# Altium project Spectrum Analyzer.PrjPcb
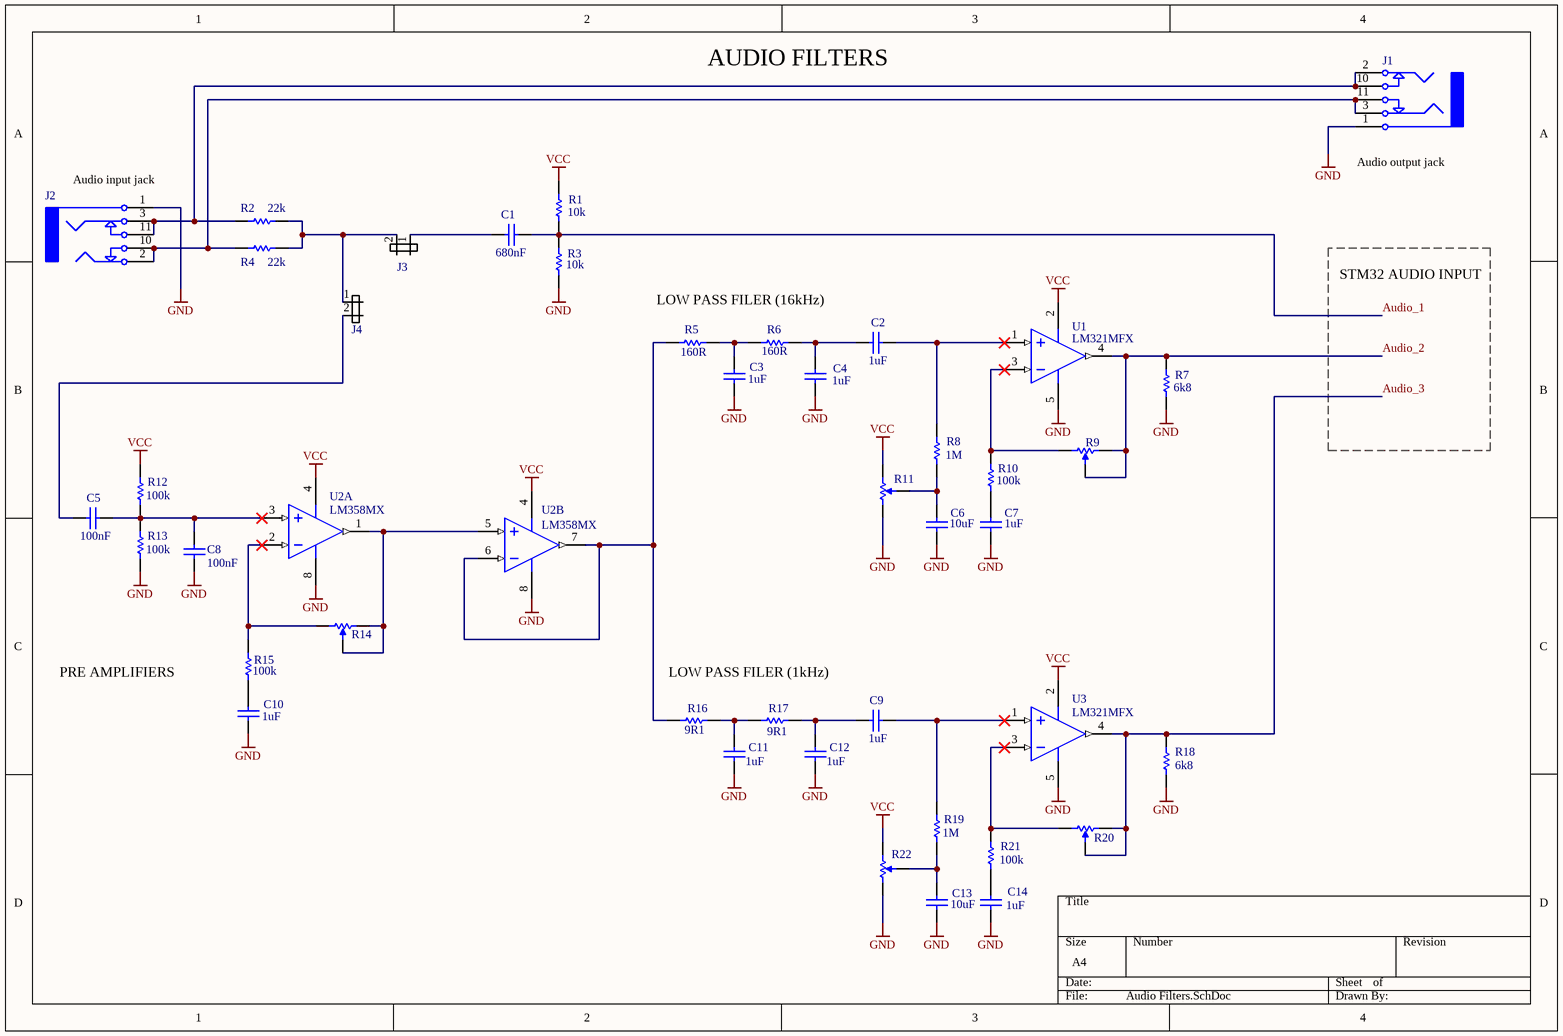
[diagram p0: Audio Filters.SchDoc]
3 sheets, 102 parts. Net scope: global (net labels, ports and power ports of the same name join across sheets).
Board file: PCB1.PcbDoc
Sheets:
  Audio Filters.SchDoc
  Control Units.SchDoc
  Power Supply.SchDoc

## Sheet Audio Filters.SchDoc
size A4

### Parts
C1  value 680nF  [CAPC0603(1608)100_N]  (hidden comment: CAP 680nF 25V 0603(1608))
C2  value 1uF  [CAPC0603(1608)100_N]  (hidden comment: CAP 1uF 16V 0603(1608))
C3  value 1uF  [CAPC0603(1608)100_N]  (hidden comment: CAP 1uF 16V 0603(1608))
C4  value 1uF  [CAPC0603(1608)100_N]  (hidden comment: CAP 1uF 16V 0603(1608))
C5  value 100nF  [CAPC0603(1608)100_N]  (hidden comment: CAP 100nF 25V 0603(1608))
C6  value 10uF  [CAPC0603(1608)100_M]  (hidden comment: CAP 10uF 6.3V 0603(1608))
C7  value 1uF  [CAPC0603(1608)100_N]  (hidden comment: CAP 1uF 16V 0603(1608))
C8  value 100nF  [CAPC0603(1608)100_N]  (hidden comment: CAP 100nF 25V 0603(1608))
C9  value 1uF  [CAPC0603(1608)100_N]  (hidden comment: CAP 1uF 16V 0603(1608))
C10  value 1uF  [CAPC0603(1608)100_N]  (hidden comment: CAP 1uF 16V 0603(1608))
C11  value 1uF  [CAPC0603(1608)100_N]  (hidden comment: CAP 1uF 16V 0603(1608))
C12  value 1uF  [CAPC0603(1608)100_N]  (hidden comment: CAP 1uF 16V 0603(1608))
C13  value 10uF  [CAPC0603(1608)100_M]  (hidden comment: CAP 10uF 6.3V 0603(1608))
C14  value 1uF  [CAPC0603(1608)100_N]  (hidden comment: CAP 1uF 16V 0603(1608))
J1  TSH-3675-BE-PA66-G  [TECHNIC-TSH-3675-BLUE_V]  (value not drawn)
J2  TSH-3675-BE-PA66-G  [TECHNIC-TSH-3675-BLUE_V]  (value not drawn)
J3  (no value)  [J_THT_HDR_1x2_R2.54-V]
J4  (no value)  [J_THT_HDR_1x2_R2.54-V]
R1  value 10k  [RESC0603(1608)_N]  (hidden comment: 10K 1% 0603(1608))
R2  value 22k  [RESC0603(1608)_L]  (hidden comment: 22K 1% 0603(1608))
R3  value 10k  [RESC0603(1608)_N]  (hidden comment: 10K 1% 0603(1608))
R4  value 22k  [RESC0603(1608)_L]  (hidden comment: 22K 1% 0603(1608))
R5  value 160R  [RESC0603(1608)_M]  (hidden comment: 160R 1% 0603(1608))
R6  value 160R  [RESC0603(1608)_M]  (hidden comment: 160R 1% 0603(1608))
R7  value 6k8  [RESC0603(1608)_L]  (hidden comment: 6K81 1% 0603(1608))
R8  value 1M  [RESC0603(1608)_L]  (hidden comment: 1M 1% 0603(1608))
R9  35WR10KLFTR  [BI-35WR10KLFTR-3_V]  (value not drawn)
R10  value 100k  [RESC0603(1608)_N]  (hidden comment: 100K 5% 0603(1608))
R11  35WR10KLFTR  [BI-35WR10KLFTR-3_V]  (value not drawn)
R12  value 100k  [RESC0603(1608)_N]  (hidden comment: 100K 5% 0603(1608))
R13  value 100k  [RESC0603(1608)_N]  (hidden comment: 100K 5% 0603(1608))
R14  35WR10KLFTR  [BI-35WR10KLFTR-3_V]  (value not drawn)
R15  value 100k  [RESC0603(1608)_N]  (hidden comment: 100K 5% 0603(1608))
R16  value 9R1  [RESC0603(1608)_M]  (hidden comment: 9R1 1% 0603(1608))
R17  value 9R1  [RESC0603(1608)_M]  (hidden comment: 9R1 1% 0603(1608))
R18  value 6k8  [RESC0603(1608)_L]  (hidden comment: 6K81 1% 0603(1608))
R19  value 1M  [RESC0603(1608)_L]  (hidden comment: 1M 1% 0603(1608))
R20  35WR10KLFTR  [BI-35WR10KLFTR-3_V]  (value not drawn)
R21  value 100k  [RESC0603(1608)_N]  (hidden comment: 100K 5% 0603(1608))
R22  35WR10KLFTR  [BI-35WR10KLFTR-3_V]  (value not drawn)
U1  LM321MFX  [DBV0005A_L]
U2  LM358MX  [D0008A_M]  (parts A,B of 2)
U3  LM321MFX  [DBV0005A_L]

### Nets
GND: C3.1 C4.1 C6.1 C7.1 C8.2 C10.1 C11.1 C12.1 C13.1 C14.1 J1.1 J2.1 R3.1 R7.1 R11.1 R13.1 R18.1 R22.1 U1.5(V+) U2.8(V+) U3.5(V+)
VCC: R1.2 R11.3 R12.2 R22.3 U1.2(V-) U2.4(GND) U3.2(V-)
Audio_1: C1.2 R1.1 R3.2
Audio_2: R7.2 R9.2 R9.3 U1.4(OUT)
Audio_3: R18.2 R20.2 R20.3 U3.4(OUT)
NetC1_1: C1.1 J3.1
NetC2_1: C2.1 R8.2 U1.1(IN+)
NetC2_2: C2.2 C4.2 R6.2
NetC3_2: C3.2 R5.2 R6.1
NetC5_1: C5.1 C8.1 R12.1 R13.2 U2.3(INA+)
NetC5_2: C5.2 J4.2
NetC6_2: C6.2 R8.1 R11.2
NetC7_2: C7.2 R10.1
NetC9_1: C9.1 R19.2 U3.1(IN+)
NetC9_2: C9.2 C12.2 R17.2
NetC10_2: C10.2 R15.1
NetC11_2: C11.2 R16.2 R17.1
NetC13_2: C13.2 R19.1 R22.2
NetC14_2: C14.2 R21.1
NetJ1_2: J1.2 J1.10 J2.3 J2.11 R2.1
NetJ1_3: J1.3 J1.11 J2.2 J2.10 R4.1
NetJ3_2: J3.2 J4.1 R2.2 R4.2
NetR5_1: R5.1 R16.1 U2.6(INB-) U2.7(OUTB)
NetR9_1: R9.1 R10.2 U1.3(IN-)
NetR14_1: R14.1 R15.2 U2.2(INA-)
NetR14_2: R14.2 R14.3 U2.1(OUTA) U2.5(INB+)
NetR20_1: R20.1 R21.2 U3.3(IN-)

### Notes on the sheet
- AUDIO FILTERS
- (near J1) Audio output jack
- (near J2) Audio input jack
- LOW PASS FILER (16kHz)
- STM32 AUDIO INPUT
- PRE AMPLIFIERS
- LOW PASS FILER (1kHz)

### Library data of the parts
C1 = CMP-1035-02722-1: CAP 680nF 25V ±10% 0603 (1608 Metric) Thickness 1mm SMD; Case-Metric: 1608; Tolerance: Â±10%; Case-EIA: 0603; Max Thickness: 1 mm; Technology: SMT; Rated Voltage: 25 V
C2-C4 C7 C9-C12 C14 = CMP-1035-02736-1: CAP 1uF 16V ±5% 0603 (1608 Metric) Thickness 1mm SMD; Case-Metric: 1608; Case-EIA: 0603; Tolerance: Â±5%; Technology: SMT; Max Thickness: 1 mm; Rated Voltage: 16 V
C5 C8 = CMP-1035-02589-1: CAP 100nF 25V ±20% 0603 (1608 Metric) Thickness 1mm SMD; Case-EIA: 0603; Tolerance: Â±20%; Case-Metric: 1608; Max Thickness: 1 mm; Technology: SMT; Rated Voltage: 25 V
C6 C13 = CMP-1035-02796-1: CAP 10uF 6.3V ±10% 0603 (1608 Metric) Thickness 1mm SMD; Case-EIA: 0603; Tolerance: Â±10%; Case-Metric: 1608; Technology: SMT; Rated Voltage: 6.3 V; Max Thickness: 1 mm
J1 J2 = CMP-0437-00002-1: Connector, 3.5mm Stereo Audio Socket, Blue; Manufacturer: Technik Industrial; Mounting Technology: Through Hole; DatasheetVersion: Feb-10; ComponentLink1URL: http://www.technik.com.hk/; ComponentLink2Description: Datasheet; PartNumber: TSH-3675-BE-PA66-G; PackageDescription: 3.5mm Stereo Audio Socket, Blue; PackageReference: TSH-3675; ComponentLink1Description: Manufacturer URL; ComponentLink2URL: http://www.technik.com.hk/images/pdf_product/SH367-PA66-C.pdf
J3 J4 = J_HDR_1x2_JUMPER: Złącze gold pin 1x2 na jumper
R1 R3 = CMP-1012-00623-1: 10K 0.1W 1% 0603 (1608 Metric)  SMD; Case-EIA: 0603; Case-Metric: 1608; Power: 0.1 W; Tolerance: 1 %; Technology: SMT
R2 R4 = CMP-1012-00659-1: 22K 0.1W 1% 0603 (1608 Metric)  SMD; Case-EIA: 0603; Case-Metric: 1608; Technology: SMT; Power: 0.1 W; Tolerance: 1 %
R5 R6 = CMP-1012-00418-1: 160R 0.1W 1% 0603 (1608 Metric)  SMD; Case-Metric: 1608; Case-EIA: 0603; Tolerance: 1 %; Technology: SMT; Power: 0.1 W
R7 R18 = CMP-1012-00605-1: 6K81 0.1W 1% 0603 (1608 Metric)  SMD; Case-EIA: 0603; Case-Metric: 1608; Tolerance: 1 %; Power: 0.1 W; Technology: SMT
R8 R19 = CMP-1012-00849-1: 1M 0.1W 1% 0603 (1608 Metric)  SMD; Case-EIA: 0603; Case-Metric: 1608; Power: 0.1 W; Tolerance: 1 %; Technology: SMT
R9 R11 R14 R20 R22 = CMP-1745-00001-1: 3 mm Single-Turn Open Frame Surface Mount Cermet Trimming Potentiometer, +/- 25%, 35 W, -40 to 125 degC, 3-Pin SMD, RoHS, Tape and Reel; Frequency: 16 MHz; Load Capacitance: 20 pF; Frequency Tolerance: 30ppm; ESR: 40 Ohm; Tolerance: 50ppm; Capacitance: 2E-11 f; Packaging: Tape and Reel; Min Operating Temperature: -20degC; Height: 0.177 inch; ComponentLink1URL: http://www.bi-technologies.net/; Radiation Hardening: No; Mount: Surface Mount; ComponentLink2Description: Datasheet; Pins: 2; Max Operating Temperature: 70degC; DatasheetVersion: Feb-10; PackageDescription: 3-Pin Surface Mount Device, Body 3 x 3.1 mm; Package Quantity: 1; RoHSCompliant: True; ComponentLink1Description: Manufacturer URL; PackageReference: 35WR10KLFTR; ComponentLink2URL: http://www.bitechnologies.com/pdfs/35.pdf; REACH SVHC: No SVHC; Resistance: 40 Ohm; Width: 0.197 inch; Length: 0.461 inch
R10 R12 R13 R15 R21 = CMP-1012-00122-1: 100K 0.1W 5% 0603 (1608 Metric)  SMD; Case-EIA: 0603; Case-Metric: 1608; Tolerance: 5 %; Power: 0.1 W; Technology: SMT
R16 R17 = CMP-1012-00280-1: 9R1 0.1W 1% 0603 (1608 Metric)  SMD; Case-Metric: 1608; Case-EIA: 0603; Technology: SMT; Tolerance: 1 %; Power: 0.1 W
U1 U3 = CMP-0055-01337-3: Low Power Single Op Amp, 5-pin SOT-23; Manufacturer: Texas Instruments; PowerWise: N; CompType: Amplifiers; PackageTopMarking: A63A*XTT; ComponentLink1Description: Datasheet URL; PackageDescription: Molded SOT-23, .115 x .063 x .040 in Body, 5 Lead, .0375 in Pitch; PinCount: 5; ComponentLink1URL: http://www.ti.com/general/docs/lit/getliterature.tsp?genericPartNumber=LM321&fileType=pdf; RoHS: N; Package Reference: DBV0005A
U2 = CMP-0055-00630-3: Low Power Dual Operational Amplifier, 8-pin Narrow SOIC; Manufacturer: Texas Instruments; PowerWise: N; PackageTopMarking: NSZXTT*LM*358M; CompType: Amplifiers; ComponentLink1URL: http://www.ti.com/general/docs/lit/getliterature.tsp?genericPartNumber=LM358-N&fileType=pdf; PinCount: 8; PackageDescription: SOIC Narrow, 4.9 x 3.9 x 1.45mm, 8 Lead, 1.27mm Pitch; Code_IPC: SOIC127P600-8; RoHS: N; Code_JEDEC: MS-012-AA; Package Reference: D0008A; ComponentLink1Description: Datasheet URL; PartId: 1

## Sheet Control Units.SchDoc
size A3
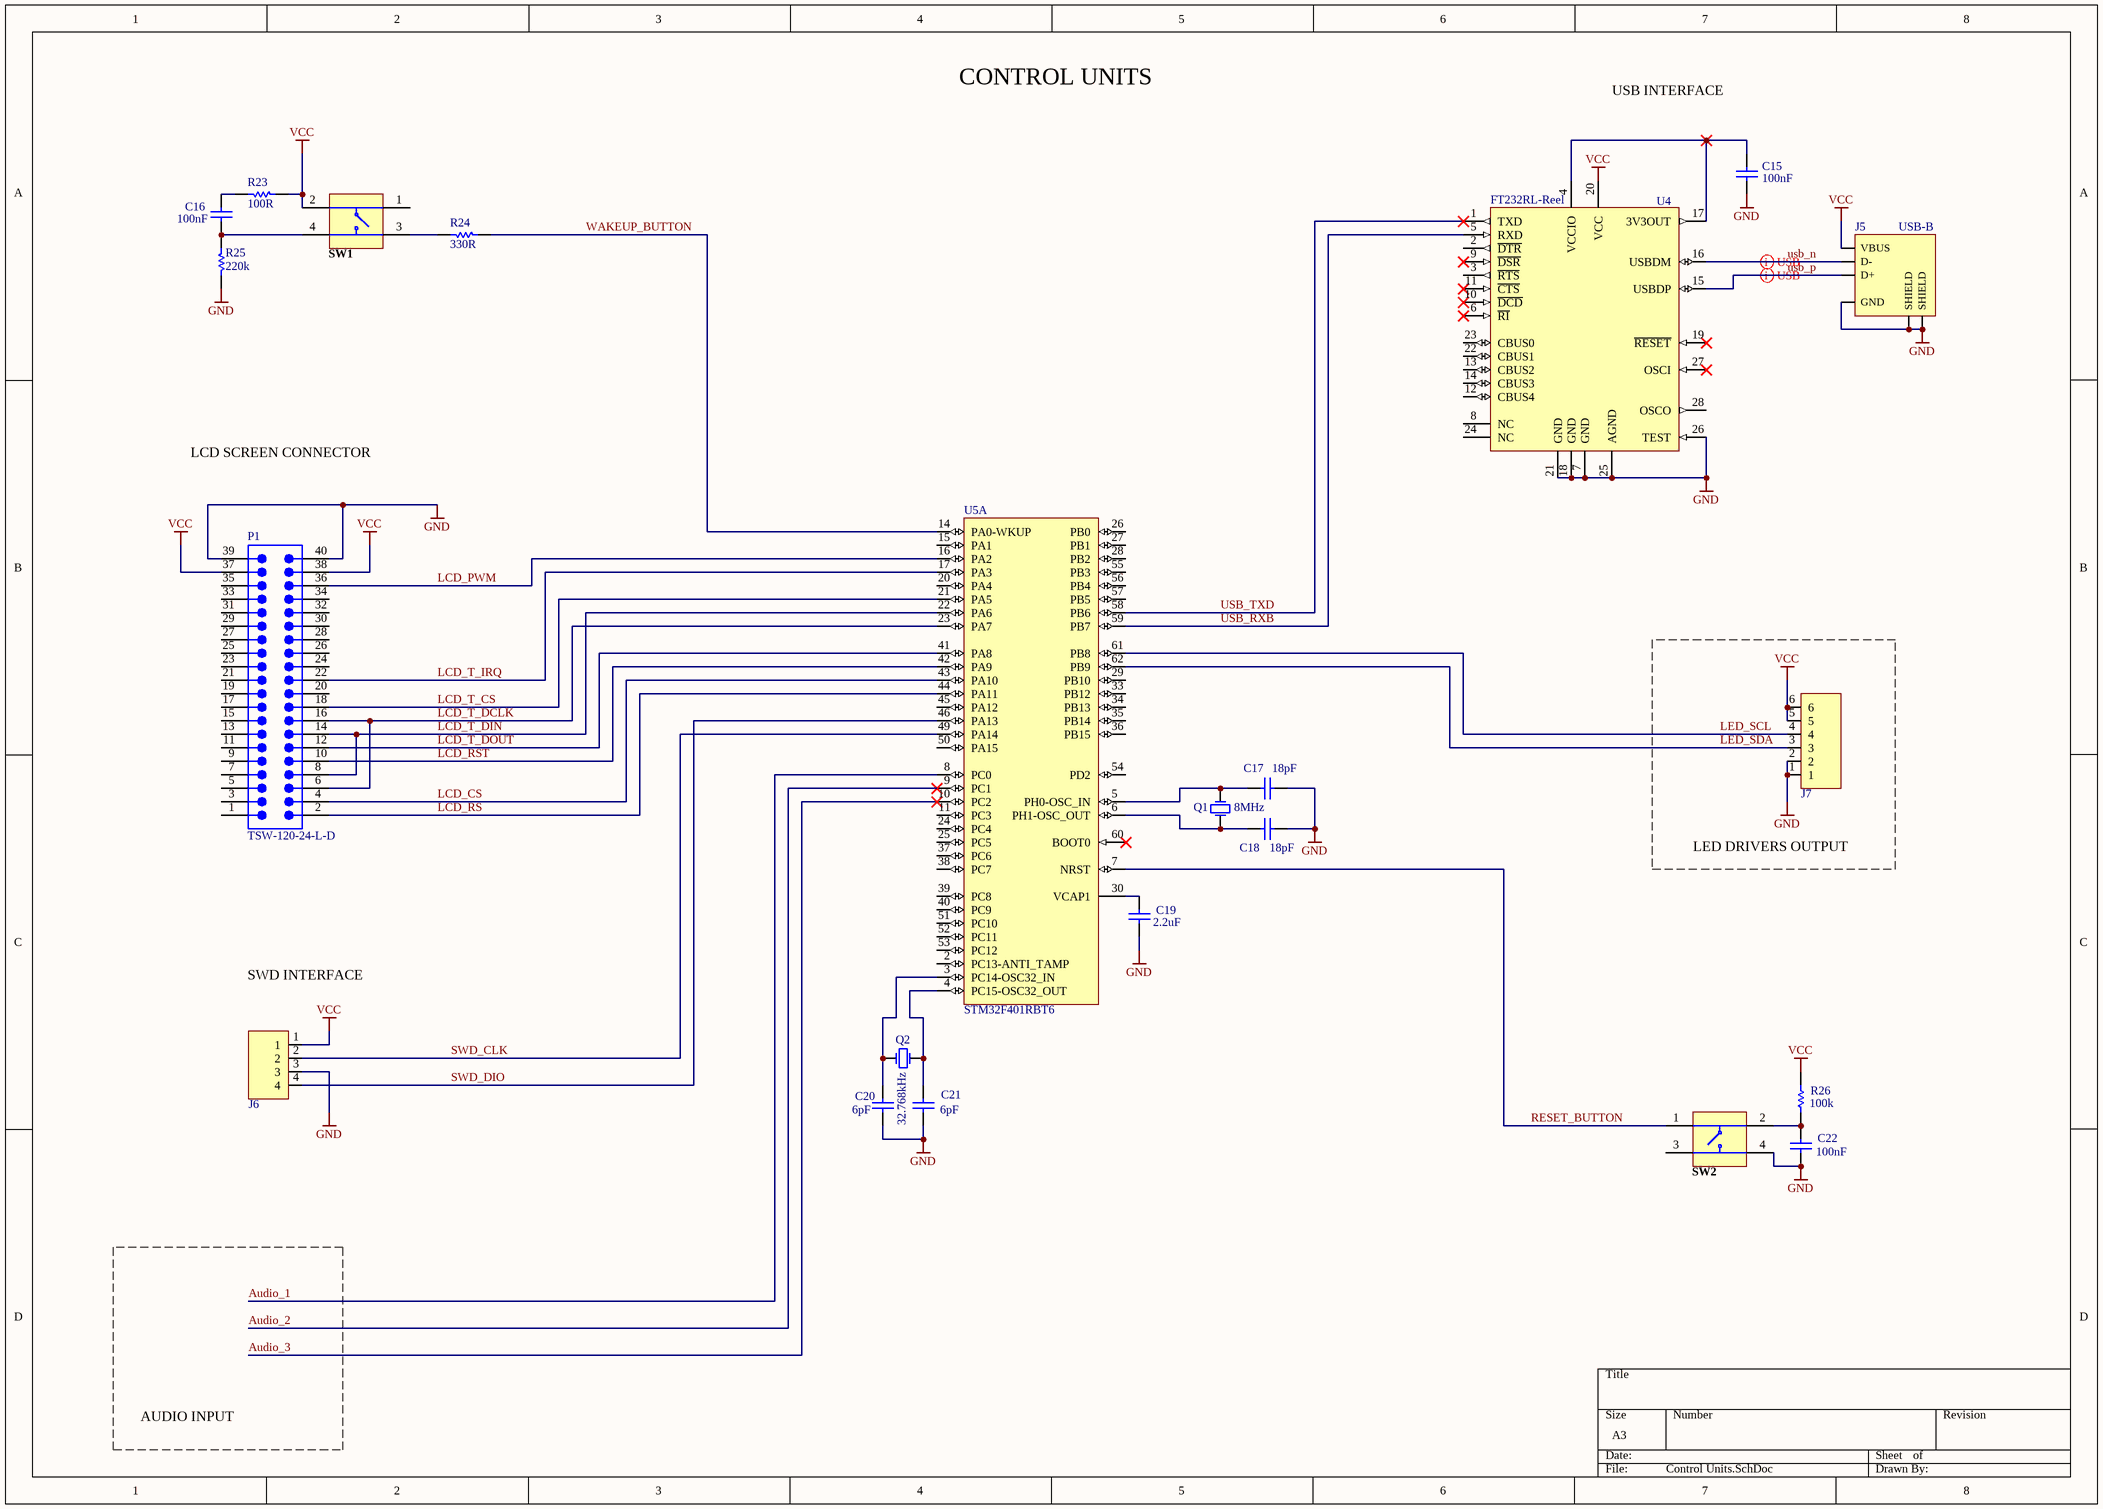
[diagram p1: Control Units.SchDoc]

### Parts
(Parts that share a designator on the sheet are numbered #1, #2 ... from top to bottom, then left to right.)
C15  value 100nF  [CAPC0603(1608)100_N]  (hidden comment: CAP 100nF 25V 0603(1608))
C16  value 100nF  [CAPC0603(1608)100_N]  (hidden comment: CAP 100nF 25V 0603(1608))
C17  value 18pF  [CAPC0603(1608)100_L]  (hidden comment: CAP 18pF 200V 0603(1608))
C18  value 18pF  [CAPC0603(1608)100_L]  (hidden comment: CAP 18pF 200V 0603(1608))
C19  value 2.2uF  [CAPC0603(1608)100_M]  (hidden comment: CAP 2.2uF 25V 0603(1608))
C20  value 6pF  [CAPC0603(1608)100_L]  (hidden comment: CAP 6pF 50V 0603(1608))
C21  value 6pF  [CAPC0603(1608)100_L]  (hidden comment: CAP 6pF 50V 0603(1608))
C22  value 100nF  [CAPC0603(1608)100_N]  (hidden comment: CAP 100nF 25V 0603(1608))
J5  USB-B  [UBS B]
J6  (no value)  [J_THT_HDR_1x4_R2.54-V]
J7  DS1021-1*40SF11  [J_THT_HDR_1x6_R2.54-V]  (value not drawn)
P1  TSW-120-24-L-D  [SMTC-TSW-120-24-X-D]
Q1  8MHz  [HC49SM]
Q2  32.768kHz  [PKG_CFPX-217]
R23  value 100R  [RESC0603(1608)_M]  (hidden comment: 100R 1% 0603(1608))
R24  value 330R  [RESC0603(1608)_L]  (hidden comment: 330R 1% 0603(1608))
R25  value 220k  [RESC0603(1608)_L]  (hidden comment: 220K 1% 0603(1608))
R26  value 100k  [RESC0603(1608)_N]  (hidden comment: 100K 5% 0603(1608))
SW1  TVCM01-038B  [JNFU-TVCM01-038B_V]  (value not drawn)
SW2  TVCM01-038B  [JNFU-TVCM01-038B_V]  (value not drawn)
U4  FT232RL-Reel  [SSOP-28_L]
U5#1  STM32F401RBT6  [STM-LQFP64_N]  (part A of 2)

### Blocks framed on the sheet
LED DRIVERS OUTPUT: J7

### Nets
GND: C15.2 C17.1 C18.1 C19.1 C20.2 C21.1 C22.2 J5.4(GND) J5.5(SHIELD) J5.6(SHIELD) J6.3 J7.1 J7.2 P1.39 P1.40 R25.1 SW2.4 U4.7(GND) U4.18(GND) U4.21(GND) U4.25(AGND) U4.26(TEST)
VCC: J5.1(VBUS) J6.1 J7.5 J7.6 P1.37 P1.38 R23.2 R26.2 SW1.2 U4.20(VCC)
Audio_1: U5#1.8(PC0)
Audio_2: U5#1.9(PC1)
Audio_3: U5#1.10(PC2)
LCD_CS: P1.4 U5#1.43(PA10)
LCD_PWM: P1.36 U5#1.16(PA2)
LCD_RS: P1.2 U5#1.44(PA11)
LCD_RST: P1.10 U5#1.42(PA9)
LCD_T_CS: P1.18 U5#1.21(PA5)
LCD_T_DCLK: P1.6 P1.16 U5#1.23(PA7)
LCD_T_DIN: P1.8 P1.14 U5#1.22(PA6)
LCD_T_DOUT: P1.12 U5#1.41(PA8)
LCD_T_IRQ: P1.22 U5#1.17(PA3)
LED_SCL: J7.4 U5#1.61(PB8)
LED_SDA: J7.3 U5#1.62(PB9)
RESET_BUTTON: SW2.1 U5#1.7(NRST)
SWD_CLK: J6.2 U5#1.49(PA14)
SWD_DIO: J6.4 U5#1.46(PA13)
usb_n: J5.3(D-) U4.16(USBDM)
usb_p: J5.2(D+) U4.15(USBDP)
USB_RXB: U4.5(RXD) U5#1.59(PB7)
USB_TXD: U4.1(TXD) U5#1.58(PB6)
WAKEUP_BUTTON: R24.1 U5#1.14(PA0-WKUP)
NetC15_1: C15.1 U4.4(VCCIO) U4.17(3V3OUT)
NetC16_1: C16.1 R23.1
NetC16_2: C16.2 R25.2 SW1.4
NetC17_2: C17.2 Q1.2(OSC2) U5#1.5(PH0-OSC_IN)
NetC18_2: C18.2 Q1.1(OSC1) U5#1.6(PH1-OSC_OUT)
NetC19_2: C19.2 U5#1.30(VCAP1)
NetC20_1: C20.1 Q2.2(OSC2) U5#1.3(PC14-OSC32_IN)
NetC21_2: C21.2 Q2.1(OSC1) U5#1.4(PC15-OSC32_OUT)
NetC22_1: C22.1 R26.1 SW2.2
NetR24_2: R24.2 SW1.3

Not connected (* = marked no-connect by the designer): P1 1 3 5 7 9 11 13 15 17 19 20 21 23 24 25 26 27 28 29 30 31 32 33 34 35; SW1 1; SW2 3; U4 2(~{DTR}) 3(~{RTS}) 6(~{RI})* 8(NC) 9(~{DSR})* 10(~{DCD})* 11(~{CTS})* 12(CBUS4) 13(CBUS2) 14(CBUS3) 19(~{RESET})* 22(CBUS1) 23(CBUS0) 24(NC) 27(OSCI)* 28(OSCO); U5#1 2(PC13-ANTI_TAMP) 11(PC3) 15(PA1) 20(PA4) 24(PC4) 25(PC5) 26(PB0) 27(PB1) 28(PB2) 29(PB10) 33(PB12) 34(PB13) 35(PB14) 36(PB15) 37(PC6) 38(PC7) 39(PC8) 40(PC9) 45(PA12) 50(PA15) 51(PC10) 52(PC11) 53(PC12) 54(PD2) 55(PB3) 56(PB4) 57(PB5) 60(BOOT0)*

### Layout directives
differential pair: usb_n, usb_p

### Notes on the sheet
- CONTROL UNITS
- USB INTERFACE
- LCD SCREEN CONNECTOR
- SWD INTERFACE
- AUDIO INPUT

### Library data of the parts
C15 C16 C22 = CMP-1035-02589-1: as C5 on sheet Audio Filters; Max Thickness: 1 mm; Technology: SMT; Rated Voltage: 25 V
C17 C18 = CMP-1035-00761-1: CAP 18pF 200V ±5% 0603 (1608 Metric) Thickness 1mm SMD; Tolerance: Â±5%; Case-Metric: 1608; Case-EIA: 0603; Max Thickness: 1 mm; Technology: SMT; Rated Voltage: 200 V
C19 = CMP-1035-02767-1: CAP 2.2uF 25V ±10% 0603 (1608 Metric) Thickness 1mm SMD; Case-EIA: 0603; Tolerance: Â±10%; Case-Metric: 1608; Technology: SMT; Max Thickness: 1 mm; Rated Voltage: 25 V
C20 C21 = CMP-1035-00393-1: CAP 6pF 50V ±0.5pF 0603 (1608 Metric) Thickness 1mm SMD; Case-EIA: 0603; Tolerance: Â±0.5pF; Case-Metric: 1608; Technology: SMT; Max Thickness: 1 mm; Rated Voltage: 50 V
J5 = USB-B: Universal Serial Bus, Type B - 90° Receptacle (TH); Manufacturer: YAMAICHI ELECTRONICS; Component_author: Kajetan Śpionek; Value: USB-B port; HelpURL: http://www.glyn.com/data/glyn/media/doc/USB-B-001-RoHs.pdf; Supplier 1: Farnell; Supplier Part Number 1: 2112373
J6 = J_HDR_1x4: Złącze gold pin
J7 = J_HDR_1x6: Złącze gold pin; EMED_ID: J_HDR_1x6_THT_HDR_1x4_R2.54-V; Producent: CONNFLY; Author_FOOTPRINT: s.szwaczyk@emed.pl; Value: DS1021-1*40SF11; ComponentLink1Description: &Datasheet; ComponentLink1URL: http://www.tme.eu/pl/Document/347cfcc6d022658d2bea6c8b28397055/DS1021.pdf; ComponentLink2Description: &Nota Aplikacyjna; ComponentLink2URL: *; Distributor1: TME; Distributor1_ID: ZL201-40G; Distributor2: *; Distributor2_ID: *; HelpURL: http://www.tme.eu/pl/Document/347cfcc6d022658d2bea6c8b28397055/DS1021.pdf; Type: *; Current_RATED: *; Author_SYMBOL: s.szwaczyk@emed.pl; ESR: *; Power_RATED: *; Producent_ID: DS1021-1*40SF11; Series: *; Temperature_RATED: *; Tolerance: *; Voltage_AC: *; Voltage_DC: *; Voltage_RATED: *
P1 = CMP-1024-00454-1: Manufacturer: Samtec; Pitch: 2.54 mm; ComponentLink1Description: Manufacturer URL; ComponentLink3URL: http://www.samtec.com/documents/webfiles/cpdf/TSW-XXX-XX-XXX-X-XX-XXX-MKT.pdf; PackageVersion: DM, 8/1988; Orientation: Vertical; Mounting Technology: Through-hole; PackageDescription: .025[0.64] SQ. Post Terminal Strip Assembly; Temperature Range: -55 to 125 degC; ComponentLink1URL: http://www.samtec.com; PartNumber: TSW-120-24-L-D; DatasheetVersion: F-214; ComponentLink2URL: http://www.samtec.com/documents/webfiles/pdf/TSW_TH.PDF; ComponentLink3Description: Package Specification; RoHS: True; PackageReference: TSW-120-24-X-D; ComponentLink2Description: Datasheet
Q1 = Q_LFXTAL003151: Kwarc 8MHz, HC49SM; Value: 8MHz
Q2 = Q_CFPX-217: Kwarc 32.768kHz, CFPX-217; Value: 32.768kHz
R23 = CMP-1012-00397-1: 100R 0.1W 1% 0603 (1608 Metric)  SMD; Case-EIA: 0603; Case-Metric: 1608; Technology: SMT; Tolerance: 1 %; Power: 0.1 W
R24 = CMP-1012-00454-1: 330R 0.1W 1% 0603 (1608 Metric)  SMD; Case-Metric: 1608; Case-EIA: 0603; Tolerance: 1 %; Technology: SMT; Power: 0.1 W
R25 = CMP-1012-00772-1: 220K 0.1W 1% 0603 (1608 Metric)  SMD; Case-EIA: 0603; Case-Metric: 1608; Tolerance: 1 %; Technology: SMT; Power: 0.1 W
R26 = CMP-1012-00122-1: as R10 on sheet Audio Filters; Tolerance: 5 %; Power: 0.1 W; Technology: SMT
SW1 SW2 = CMP-0224-00001-1: Switch, Push Button, 50 mA, 12V DC, SMD; Mechanical Life: 100,000 cycles; PackageReference: TVCM01-038B; Operating Temperature: -30 to 85 degC; ComponentLink1URL: http://www.jian-fu.com/; ComponentLink2Description: Datasheet; Mounting Technology: Suface Mount; Case Size: 4.5 x 4.5; ComponentLink1Description: Manufacturer URL; PartNumber: TVCM01-038B; ComponentLink2URL: http://www.jian-fu.com/product-61.html; PackageDescription: 4-Pin Surface Mount Switch, 4.5 x 4.5 mm Body
U4 = CMP-0078-00029-3: USB UART Asynchronous Serial Data Transfer Chip, 28-pin SSOP, Tape and Reel; Manufacturer: FTDI; PackageVersion: Mar-12; PackageReference: SSOP-28; ComponentLink2Description: Datasheet; DatasheetVersion: ver 2.10, Mar-2012; PackageDescription: 28-Pin Small Outline Package 0.65 mm Pitch; ComponentLink1Description: Manufacturer URL; RevisionNote: DatasheetVersion updated to 2.10 Mar-2012; PartNumber: FT232RL-Reel; ComponentLink1URL: http://www.ftdichip.com/; ComponentLink2URL: http://www.ftdichip.com/Support/Documents/DataSheets/ICs/DS_FT232R.pdf
U5#1 = CMP-0243-00094-2: ARM Cortex-M4 32-bit MCU+FPU, 105 DMIPS, 128 kB Flash, 64 kB Internal RAM, 48 I/Os, 64-pin LQFP, -40 to 85 degC, Tray; Manufacturer: STMicroelectronics; Internal RAM Size (kB): 64; FLASH Size (Prog) (kB): 128; Supply Voltage(Vcc) max (V): 3.6; I/Os (High Current): 48; Supply Voltage(Vcc) min (V): 1.8; Operating Frequency(F) (Processor speed) (MHz): 84; Core: ARM Cortex-M4; PackageDescription: 64-Pin Low Profile Quad Flat Package, 10 x 10 mm Body, 0.5 mm Pitch; Mounting Technology: Surface Mount; PackageVersion: Rev. 4, 06/2013; ComponentLink1URL: http://www.st.com/web/en/home.html; ComponentLink3Description: Package Specification; ComponentLink2Description: Datasheet; ComponentLink3URL: http://www.st.com/st-web-ui/static/active/en/resource/technical/document/datasheet/DM00037051.pdf; ComponentLink2URL: http://www.st.com/st-web-ui/static/active/en/resource/technical/document/data_brief/DM00071938.pdf; DatasheetVersion: Rev. 1; Packing: Tray; PackageReference: LQFP64; PartNumber: STM32F401RBT6; ComponentLink1Description: Manufacturer URL; PartId: 1

## Sheet Power Supply.SchDoc
size A4; Author: KAJETAN ŚPIONEK; SheetNumber: 1
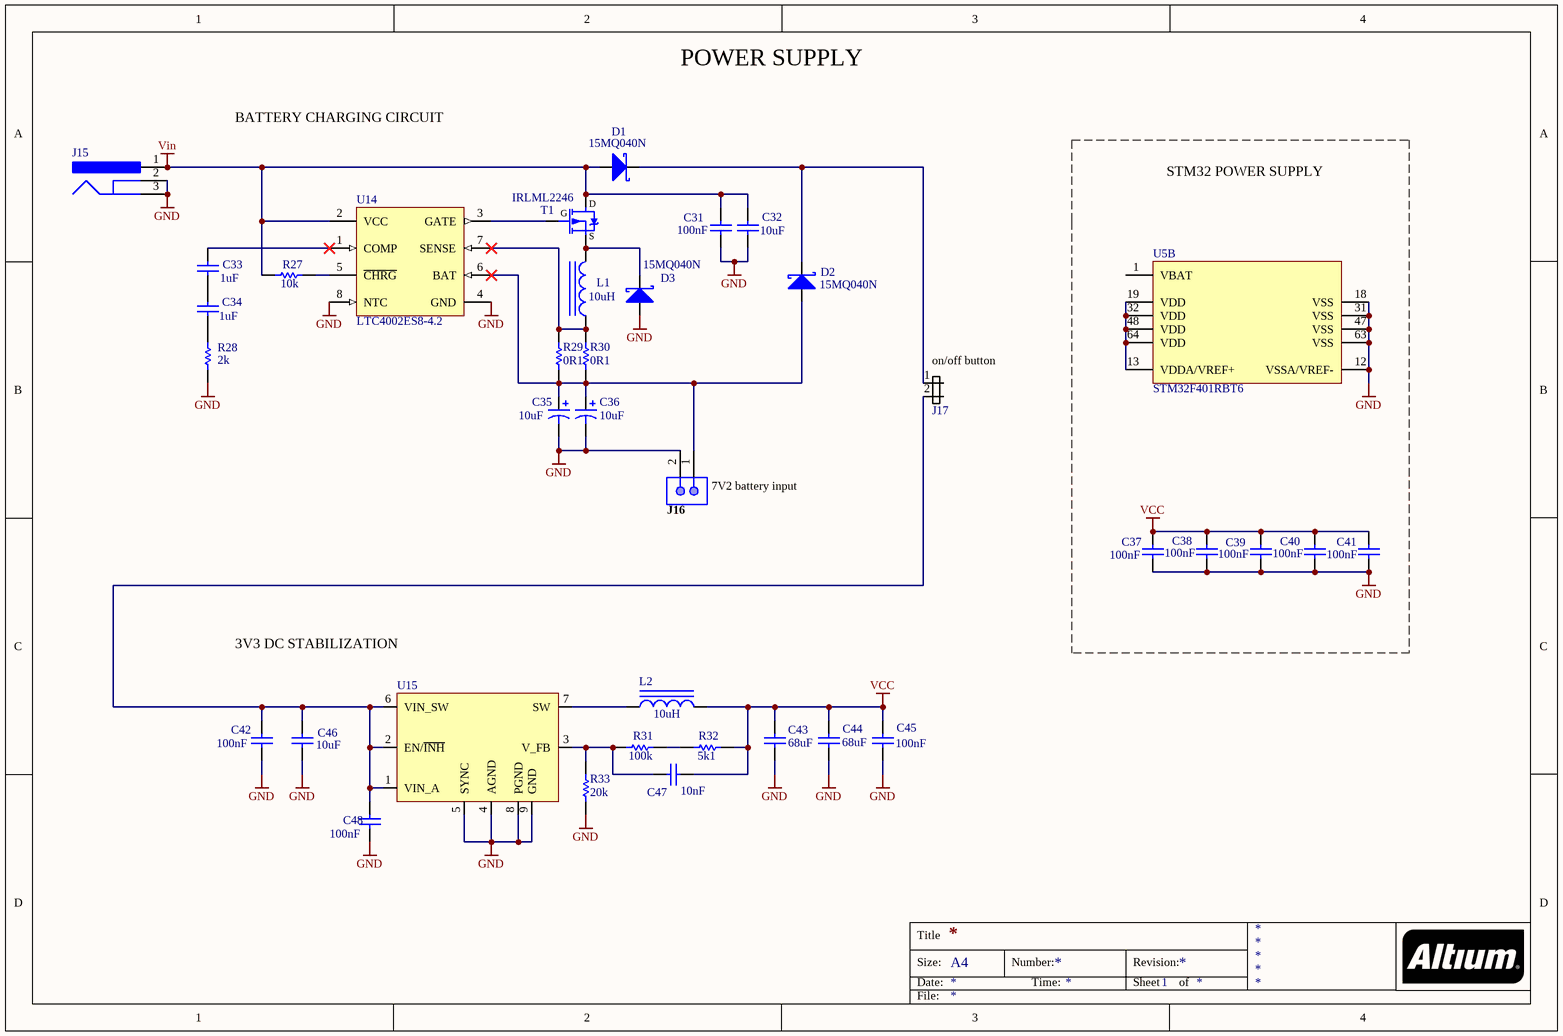
[diagram p2: Power Supply.SchDoc]

### Parts
(Parts that share a designator on the sheet are numbered #1, #2 ... from top to bottom, then left to right.)
C31  value 100nF  [CAPC0603(1608)100_N]  (hidden comment: CAP 100nF 25V 0603(1608))
C32  value 10uF  [CAPC0603(1608)100_M]  (hidden comment: CAP 10uF 6.3V 0603(1608))
C33  value 1uF  [CAPC0603(1608)100_N]  (hidden comment: CAP 1uF 16V 0603(1608))
C34  value 1uF  [CAPC0603(1608)100_N]  (hidden comment: CAP 1uF 16V 0603(1608))
C35  Capacitance: 10uF  [AVX-CAPC3528_V]  (hidden comment: TAJB106K020R)
C36  Capacitance: 10uF  [AVX-CAPC3528_V]  (hidden comment: TAJB106K020R)
C37  value 100nF  [CAPC0603(1608)100_N]  (hidden comment: CAP 100nF 25V 0603(1608))
C38  value 100nF  [CAPC0603(1608)100_N]  (hidden comment: CAP 100nF 25V 0603(1608))
C39  value 100nF  [CAPC0603(1608)100_N]  (hidden comment: CAP 100nF 25V 0603(1608))
C40  value 100nF  [CAPC0603(1608)100_N]  (hidden comment: CAP 100nF 25V 0603(1608))
C41  value 100nF  [CAPC0603(1608)100_N]  (hidden comment: CAP 100nF 25V 0603(1608))
C42  value 100nF  [CAPC0603(1608)100_N]  (hidden comment: CAP 100nF 25V 0603(1608))
C43  value 68uF  [CAPC1210(3225)220_M]  (hidden comment: CAP 68uF 6.3V 1210(3225))
C44  value 68uF  [CAPC1210(3225)220_M]  (hidden comment: CAP 68uF 6.3V 1210(3225))
C45  value 100nF  [CAPC0603(1608)100_N]  (hidden comment: CAP 100nF 25V 0603(1608))
C46  value 10uF  [CAPC0603(1608)100_M]  (hidden comment: CAP 10uF 6.3V 0603(1608))
C47  value 10nF  [CAPC0603(1608)100_L]  (hidden comment: CAP 10nF 16V 0603(1608))
C48  value 100nF  [CAPC0603(1608)100_N]  (hidden comment: CAP 100nF 25V 0603(1608))
D1  15MQ040N  [D_SMD_SMA]
D2  15MQ040N  [D_SMD_SMA]
D3  15MQ040N  [D_SMD_SMA]
J15  KLDX-0202-A  [KYCN-KLDX-0202-A_V]  (value not drawn)
J16  PH2541-2-SPGRH-6-3  [PH2541-2-SPGRH-6-3_V]  (value not drawn)
J17  (no value)  [J_THT_HDR_1x2_R2.54-V]
L1  value 10uH  [PKG_DER0705]  (hidden comment: 10uH DER0705-10)
L2  10uH  [PKG_DLCSS124P-100M]
R27  value 10k  [RESC0603(1608)_N]  (hidden comment: 10K 1% 0603(1608))
R28  value 2k  [RESC0603(1608)_N]  (hidden comment: 2K 1% 0603(1608))
R29  value 0R1  [RESC0603(1608)_N]  (hidden comment: 10K 1% 0603(1608))
R30  value 0R1  [RESC0603(1608)_N]  (hidden comment: 10K 1% 0603(1608))
R31  value 100k  [RESC0603(1608)_N]  (hidden comment: 100K 5% 0603(1608))
R32  value 5k1  [RESC0603(1608)_M]  (hidden comment: 5K1 1% 0603(1608))
R33  value 20k  [RESC0603(1608)_L]  (hidden comment: 20K 1% 0603(1608))
T1  IRLML2246  [SOT-23]
U5#2  STM32F401RBT6  [STM-LQFP64_N]  (part B of 2)
U14  LTC4002ES8-4.2  [LT-S8-8_L]
U15  (no value)  [SO8-N_THERMAL]

### Blocks framed on the sheet
STM32 POWER SUPPLY: C37-C41 U5#2

### Nets
GND: C31.1 C32.1 C35.2 C36.2 C37.1 C38.1 C39.1 C40.1 C41.1 C42.1 C43.1 C44.1 C45.1 C46.1 C48.1 D3.1(A) J15.2 J15.3 J16.2 R28.1 R33.1 U5#2.12(VSSA/VREF-) U5#2.18(VSS) U5#2.31(VSS) U5#2.47(VSS) U5#2.63(VSS) U14.4(GND) U14.8(NTC) U15.4(AGND) U15.5(SYNC) U15.8(PGND) U15.9(GND)
VCC: C37.2 C38.2 C39.2 C40.2 C41.2 C43.2 C44.2 C45.2 C47.2 L2.2 R32.2
Vin: C31.2 C32.2 D1.1(A) J15.1 R27.2 T1.3(D) U14.2(VCC)
NetC33_1: C33.1 C34.2
NetC33_2: C33.2 U14.1(COMP)
NetC34_1: C34.1 R28.2
NetC35_1: C35.1 C36.1 D2.1(A) J16.1 R29.2 R30.2 U14.6(BAT)
NetC42_2: C42.2 C46.2 C48.2 J17.2 U15.1(VIN_A) U15.2(EN/~{INH}) U15.6(VIN_SW)
NetC47_1: C47.1 R31.1 R33.2 U15.3(V_FB)
NetD1_2: D1.2(K) D2.2(K) J17.1
NetD3_2: D3.2(K) L1.1 T1.2(S)
NetL1_2: L1.2 R29.1 R30.1 U14.7(SENSE)
NetL2_1: L2.1 U15.7(SW)
NetR27_1: R27.1 U14.5(~{CHRG})
NetR31_2: R31.2 R32.1
NetT1_1: T1.1(G) U14.3(GATE)
NetU5#2_13: U5#2.13(VDDA/VREF+) U5#2.19(VDD) U5#2.32(VDD) U5#2.48(VDD) U5#2.64(VDD)

Not connected (* = marked no-connect by the designer): U5#2 1(VBAT)

### Notes on the sheet
- POWER SUPPLY
- BATTERY CHARGING CIRCUIT
- (near J17) on/off button
- (near J16) 7V2 battery input
- 3V3 DC STABILIZATION
- Title
- Size:
- Date:
- A4
- Number:
- Time:
- Revision:
- Sheet
- of
- File:

### Library data of the parts
C31 C37-C42 C45 C48 = CMP-1035-02589-1: as C5 on sheet Audio Filters; Max Thickness: 1 mm; Technology: SMT; Rated Voltage: 25 V
C32 C46 = CMP-1035-02796-1: as C6 on sheet Audio Filters; Technology: SMT; Rated Voltage: 6.3 V; Max Thickness: 1 mm
C33 C34 = CMP-1035-02736-1: as C2 on sheet Audio Filters; Technology: SMT; Max Thickness: 1 mm; Rated Voltage: 16 V
C35 C36 = CMP-0279-00001-1: Capacitor, Tantalum, 10uF 10% 20V MCCT-B (3528); Manufacturer: AVX; Polarity: Polarized; PartNumber: TAJB106K020R; PackageDescription: 2-Pin SMT Capacitor, 3.5 x 2.8 mm Body; ComponentLink1URL: http://www.avx.com/; PackageReference: CAPC3528; ComponentLink2Description: Datasheet; Technology: Tantalum; ComponentLink2URL: http://www.avx.com/docs/Catalogs/taj.pdf; Tolerance: 10%; ComponentLink1Description: Manufacturer URL; Rated Voltage: 20V; DatasheetVersion: Jun-13; Mounting Technology: Surface Mount
C43 C44 = CMP-1038-02298-1: CAP 68uF 6.3V ±20% 1210 (3225 Metric) Thickness 2.2mm SMD; Case-Metric: 3225; Tolerance: Â±20%; Case-EIA: 1210; Technology: SMT; Max Thickness: 2.2 mm; Rated Voltage: 6.3 V
C47 = CMP-1035-02312-1: CAP 10nF 16V ±20% 0603 (1608 Metric) Thickness 1mm SMD; Case-EIA: 0603; Tolerance: Â±20%; Case-Metric: 1608; Max Thickness: 1 mm; Technology: SMT; Rated Voltage: 16 V
D1-D3 = D_15MQ040N: Dioda Schottky SMD 15MQ040N, 3A, 40V; Value: 15MQ040N
J15 = CMP-1673-00001-5: DC Power Jack, 24 V, 3.5 A, -25 to 85 degC, 3-Pin THD, RoHS; Manufacturer: Kycon; Voltage Rating: 24 V; Current Rating: 3.5 A; Height: 10.8 mm; Length: 9.2 mm; Pins: 2; Housing Material: PBT; Connector Type: Power; ComponentLink2URL: http://www.kycon.com/Pub_Eng_Draw/KLDX-0202-X.PDF; PackageDescription: 3-Pin Through Hole Device, Body 14.5 x 9 mm; Max Operating Temperature: 85 degC; Min Operating Temperature: -25 degC; PackageReference: KLDX-0202-A; Contact Gender: Female; Package Quantity: 500; Mount: Through Hole; Colour: Black; Contact Plating: Tin; DatasheetVersion: Rev. D3, 06/2013; ComponentLink2Description: Datasheet; RoHSCompliant: true; Mounting Technology: Through Hole; ComponentLink1Description: Manufacturer URL; Contact Material: Brass; ComponentLink1URL: http://www.kycon.com/
J16 = CMP-0261-00001-1: Male Header, Pitch 2.54mm, 2x1 Position, Mated Height 6mm, Tail Length 3mm; PackageDescription: 2-Pin Male Header IDC, 2.54 x 5.08 mm Body, 2.54 mm Pitch; PartNumber: PH2541-2-SPGRH-6-3; ComponentLink1URL: http://www.suzhoupinchao.com/; Mounting Technology: Through Hole; ComponentLink1Description: Manufacturer URL; PackageReference: PH2541-2-SPGRH-6-3
J17 = J_HDR_1x2_JUMPER: Złącze gold pin 1x2 na jumper
L1 = L_10uH_DER0705-10: Dławik mocy SMD DER0705-10, 10uH, 20%, 1.63A
L2 = L_DLCSS124P-100M: Dławik mocy SMD CSS124P100M, 10uH, 20%, 4.5A; Value: 10uH
R27 = CMP-1012-00623-1: as R1 on sheet Audio Filters; Power: 0.1 W; Tolerance: 1 %; Technology: SMT
R28 = CMP-1012-00542-1: 2K 0.1W 1% 0603 (1608 Metric)  SMD; Case-EIA: 0603; Case-Metric: 1608; Power: 0.1 W; Technology: SMT; Tolerance: 1 %
R29 R30 = CMP-1012-00623-1: 0R1 0.1W 1% 0603 (1608 Metric)  SMD; Case-EIA: 0603; Case-Metric: 1608; Power: 0.1 W; Tolerance: 1 %; Technology: SMT
R31 = CMP-1012-00122-1: as R10 on sheet Audio Filters; Tolerance: 5 %; Power: 0.1 W; Technology: SMT
R32 = CMP-1012-00590-1: 5K1 0.1W 1% 0603 (1608 Metric)  SMD; Case-Metric: 1608; Case-EIA: 0603; Power: 0.1 W; Technology: SMT; Tolerance: 1 %
R33 = CMP-1012-00655-1: 20K 0.1W 1% 0603 (1608 Metric)  SMD; Case-Metric: 1608; Case-EIA: 0603; Technology: SMT; Tolerance: 1 %; Power: 0.1 W
T1 = T_IRLML2246TRPbF: Tranzystor unipolarny P-MOSFET, HEXFET, -2.6A, -20V; Value: IRLML2246
U5#2 = CMP-0243-00094-2: as U5#1 on sheet Control Units; Core: ARM Cortex-M4; PackageDescription: 64-Pin Low Profile Quad Flat Package, 10 x 10 mm Body, 0.5 mm Pitch; Mounting Technology: Surface Mount; PackageVersion: Rev. 4, 06/2013; ComponentLink1URL: http://www.st.com/web/en/home.html; ComponentLink3Description: Package Specification; ComponentLink2Description: Datasheet; ComponentLink3URL: http://www.st.com/st-web-ui/static/active/en/resource/technical/document/datasheet/DM00037051.pdf; ComponentLink2URL: http://www.st.com/st-web-ui/static/active/en/resource/technical/document/data_brief/DM00071938.pdf; DatasheetVersion: Rev. 1; Packing: Tray; PackageReference: LQFP64; PartNumber: STM32F401RBT6; ComponentLink1Description: Manufacturer URL; PartId: 1
U14 = CMP-0471-00510-1: Standalone Li-Ion Switch Mode Battery Charger, 4.7 to 22 V Vin, 8-pin SOIC (S8-8), -40 to 85 degC; Manufacturer: Linear Technology; Battery Chemistry: Li-Ion, Li-Polymer; Vin Min(V): 4.7; Type of Charger: Switching; Number of Cells: 1; Vin Max(V): 22; Charge Termination: On-board timer; Float Voltage: 4.2 V; ComponentLink1URL: http://www.linear.com/; PartNumber: LTC4002ES8-4.2; PackageReference: S8-8; ComponentLink2URL: http://cds.linear.com/docs/en/datasheet/4002f.pdf; ComponentLink3Description: Package Specification; ComponentLink3URL: http://cds.linear.com/docs/en/packaging/05081610_G_SO8.pdf; Mounting Technology: Surface Mount; RoHS: FALSE; ComponentLink1Description: Manufacturer URL; PackageVersion: Rev. G, 03/2012; ComponentLink2Description: Datasheet; PackageDescription: 8-Pin Plastic Small Outline (Narrow .150 Inch), Body 4.9 x 3.9 mm, Pitch 1.27 mm
U15 = U_ST1S10PHR: Przetwornica step-down synchroniczna, 3 A, 900 kHz

## Nets that join several sheets
GND: Audio Filters (21 pins), Control Units (22 pins), Power Supply (32 pins)
VCC: Audio Filters (7 pins), Control Units (10 pins), Power Supply (11 pins)
Audio_1: Audio Filters (C1.2 R1.1 R3.2), Control Units (U5#1.8)
Audio_2: Audio Filters (R7.2 R9.2 R9.3 U1.4), Control Units (U5#1.9)
Audio_3: Audio Filters (R18.2 R20.2 R20.3 U3.4), Control Units (U5#1.10)